# Altium schematic sheet 电子琴1组.SchDoc
size A4; SheetNumber: 1; SheetTotal: 1
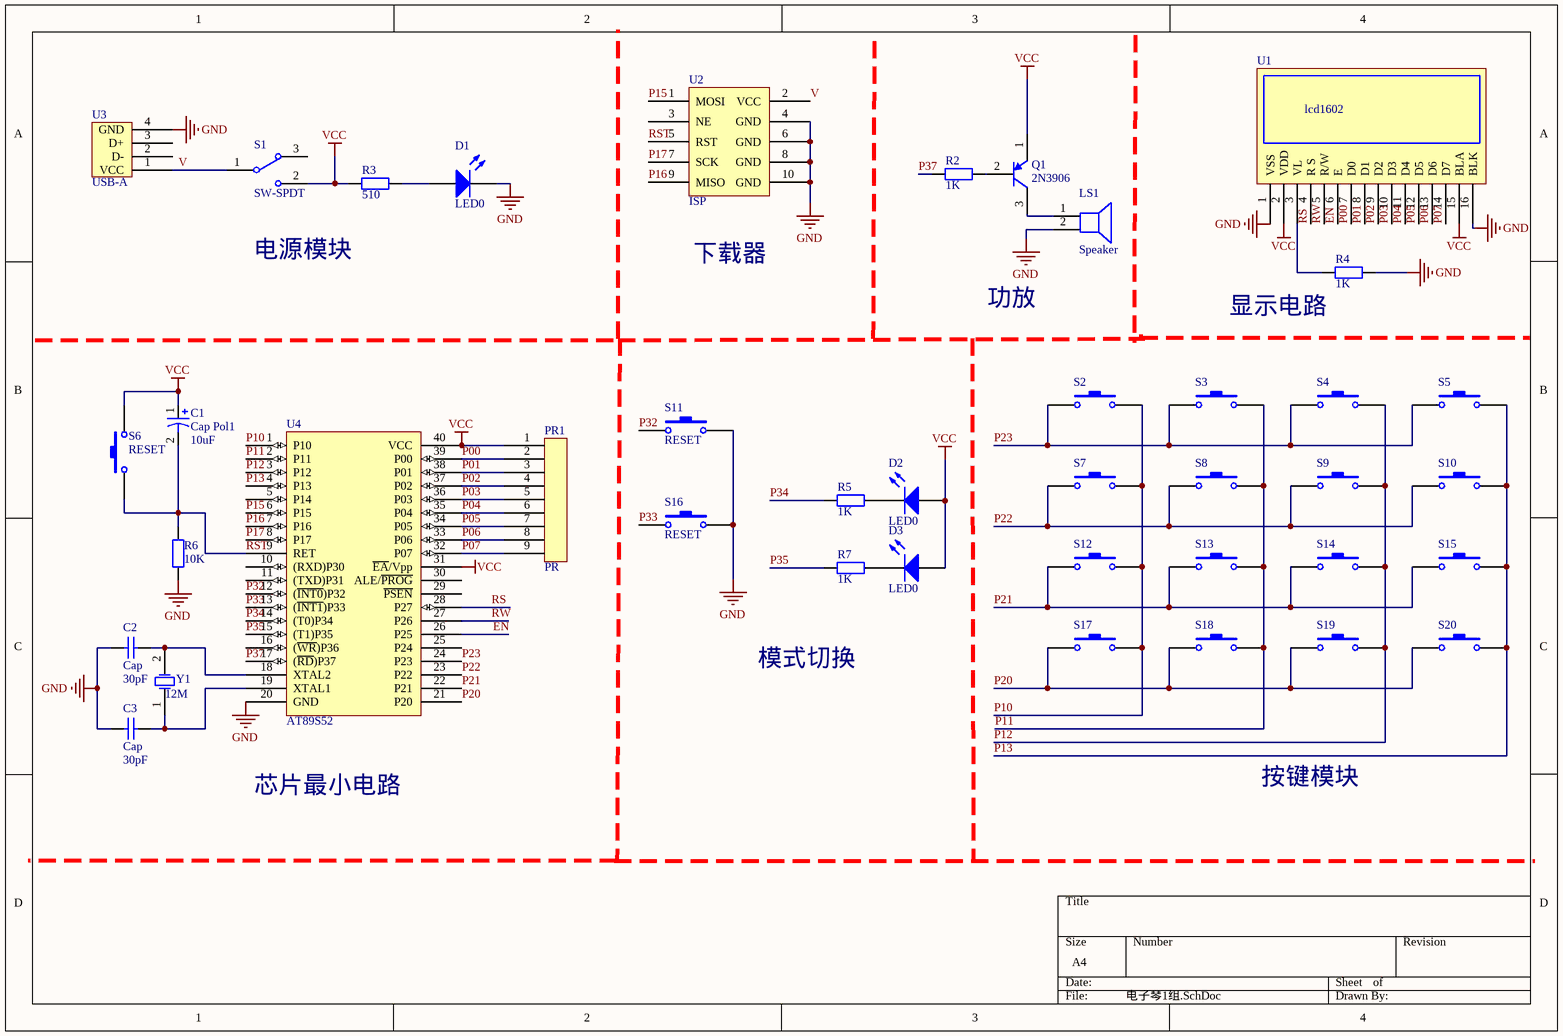
[diagram p0: 电子琴1组.SchDoc]

## Parts
C1  Cap Pol1  value 10uF  [RB0.1]
C2  Cap  value 30pF  [RAD-0.1]
C3  Cap  value 30pF  [RAD-0.1]
D1  LED0  [RB0.1]
D2  LED0  [RB0.1]
D3  LED0  [RB0.1]
LS1  Speaker  [Speaker]
PR1  PR  [SIP9]
Q1  2N3906  [TO-92-M]
R2  1K  [AXIAL-0.3]
R3  510  [AXIAL-0.3]
R4  1K  [AXIAL-0.3]
R5  1K  [AXIAL-0.3]
R6  10K  [AXIAL-0.3]
R7  1K  [AXIAL-0.3]
S1  SW-SPDT  [KEY-6 - duplicate]
S2  (no value)  [SPST6*6]
S3  (no value)  [SPST6*6]
S4  (no value)  [SPST6*6]
S5  (no value)  [SPST6*6]
S6  RESET  [SPST6*6]
S7  (no value)  [SPST6*6]
S8  (no value)  [SPST6*6]
S9  (no value)  [SPST6*6]
S10  (no value)  [SPST6*6]
S11  RESET  [SPST6*6]
S12  (no value)  [SPST6*6]
S13  (no value)  [SPST6*6]
S14  (no value)  [SPST6*6]
S15  (no value)  [SPST6*6]
S16  RESET  [SPST6*6]
S17  (no value)  [SPST6*6]
S18  (no value)  [SPST6*6]
S19  (no value)  [SPST6*6]
S20  (no value)  [SPST6*6]
U1  lcd1602  [LCD1602]
U2  ISP  [IDC10]
U3  USB-A  [USB_A]
U4  AT89S52  [DIP40_51MCU]
Y1  12M  [XTAL1]

## Nets
GND: C2.1 C3.1 D1.2(K) LS1.2 R4.2 R6.1 S11.2 S16.2 U1.1(VSS) U1.16(BLK) U2.4(GND) U2.6(GND) U2.8(GND) U2.10(GND) U3.4(GND) U4.20(GND)
VCC: C1.1 D2.1(A) D3.1(A) PR1.1 Q1.1(E) R3.1 S1.2 S6.2 U1.2(VDD) U1.15(BLA) U4.31(~{EA}/Vpp) U4.40(VCC)
EN: U1.6(E) U4.26(P25)
P00: PR1.2 U1.7(D0) U4.39(P00)
P01: PR1.3 U1.8(D1) U4.38(P01)
P02: PR1.4 U1.9(D2) U4.37(P02)
P03: PR1.5 U1.10(D3) U4.36(P03)
P04: PR1.6 U1.11(D4) U4.35(P04)
P05: PR1.7 U1.12(D5) U4.34(P05)
P06: PR1.8 U1.13(D6) U4.33(P06)
P07: PR1.9 U1.14(D7) U4.32(P07)
P10: S2.2 S7.2 S12.2 S17.2 U4.1(P10)
P11: S3.2 S8.2 S13.2 S18.2 U4.2(P11)
P12: S4.2 S9.2 S14.2 S19.2 U4.3(P12)
P13: S5.2 S10.2 S15.2 S20.2 U4.4(P13)
P15: U2.1(MOSI) U4.6(P15)
P16: U2.9(MISO) U4.7(P16)
P17: U2.7(SCK) U4.8(P17)
P20: S17.1 S18.1 S19.1 S20.1 U4.21(P20)
P21: S12.1 S13.1 S14.1 S15.1 U4.22(P21)
P22: S7.1 S8.1 S9.1 S10.1 U4.23(P22)
P23: S2.1 S3.1 S4.1 S5.1 U4.24(P23)
P32: S11.1 U4.12((~{INT0})P32)
P33: S16.1 U4.13((~{INT1})P33)
P34: R5.1 U4.14((T0)P34)
P35: R7.1 U4.15((T1)P35)
P37: R2.2 U4.17((~{RD})P37)
RS: U1.4(R_S) U4.28(P27)
RST: C1.2 R6.2 S6.1 U2.5(RST) U4.9(RET)
RW: U1.5(R/W) U4.27(P26)
V: S1.1 U2.2(VCC) U3.1(VCC)
NetC2_2: C2.2 U4.18(XTAL2) Y1.2(OSC2)
NetC3_2: C3.2 U4.19(XTAL1) Y1.1(OSC1)
NetD1_1: D1.1(A) R3.2
NetD2_2: D2.2(K) R5.2
NetD3_2: D3.2(K) R7.2
NetLS1_1: LS1.1 Q1.3(C)
NetQ1_2: Q1.2(B) R2.1
NetR4_1: R4.1 U1.3(VL)

Not connected (* = marked no-connect by the designer): S1 3; U2 3(NE); U3 2(D-) 3(D+); U4 5(P14) 10((RXD)P30) 11((TXD)P31) 16((~{WR})P36) 25(P24) 29(~{PSEN}) 30(ALE/~{PROG})

## Notes on the sheet
- 电源模块
- 下载器
- 功放
- 显示电路
- 模式切换
- 按键模块
- 芯片最小电路

## Library data of the parts
C1 = Cap Pol1: Polarized Capacitor (Radial); Published: 8-Jun-2000; LatestRevisionDate: 17-Jul-2002; LatestRevisionNote: Re-released for DXP Platform.; PackageReference: RB7.6-15; Publisher: Altium Limited; PackageDescription: Polarized Capacitor (Radial); 2 Leads
C2 C3 = Cap: Capacitor; Published: 8-Jun-2000; LatestRevisionDate: 17-Jul-2002; LatestRevisionNote: Re-released for DXP Platform.; PackageReference: RAD-0.3; Publisher: Altium Limited; PackageDescription: Radial Cap, Thru-Hole; 2 Leads; 0.3 in Pin Spacing
D1-D3 = LED0: Typical INFRARED GaAs LED; Published: 8-Jun-2000; LatestRevisionDate: 08-Jul-2005; LatestRevisionNote: Mech Layer 1 removed.; PackageReference: LED-0; Publisher: Altium Limited; PackageDescription: LED; 2 Leads
LS1 = Speaker: Loudspeaker; Published: 24-Mar-1999; LatestRevisionDate: 17-Jul-2002; LatestRevisionNote: Re-released for DXP Platform.; PackageReference: PIN2; Publisher: Altium Limited
Q1 = 2N3906: PNP General Purpose Amplifier; Published: 8-Jun-2000; LatestRevisionDate: 15-Jan-2003; LatestRevisionNote: PCB Footprint 'BCY-W3/D4.7' replaced; DatasheetVersion: 1997; PackageVersion: Sep-1998; PackageReference: TO-92A; Publisher: Altium Limited; PackageDescription: TO, Flat Index; 3 In-Line, Axial Leads; Body Dia. 4.5mm; Leads 0.51 x 0.48 mm (max); ComponentLink1Description: Manufacturer Link; ComponentLink1URL: http://www.fairchildsemi.com/; ComponentLink2Description: Datasheet; ComponentLink2URL: http://www.fairchildsemi.com/ds/2N%2F2N3906.pdf
R2 R4 R5 R7 = Res2: Resistor; Value: 10K; Published: 8-Jun-2000; LatestRevisionDate: 17-Jul-2002; LatestRevisionNote: Re-released for DXP Platform.; PackageReference: AXIAL-0.4; Publisher: Altium Limited; PackageDescription: Axial Device, Thru-Hole; 2 Leads; 0.4 in Pin Spacing
R3 R6 = Res2: Resistor; Published: 8-Jun-2000; LatestRevisionDate: 17-Jul-2002; LatestRevisionNote: Re-released for DXP Platform.; PackageReference: AXIAL-0.4; Publisher: Altium Limited; PackageDescription: Axial Device, Thru-Hole; 2 Leads; 0.4 in Pin Spacing
  R3: Value: 510
  R6: Value: 10K
S1 = SW-SPDT: SPDT Subminiature Toggle Switch, Right Angle Mounting, Vertical Actuation; Published: 24-Mar-1999; LatestRevisionDate: 17-Dec-2003; LatestRevisionNote: Schematic revised, PCB Footprint replaced.; DatasheetVersion: 05-Dec-2000; PackageReference: TL36WW15050; Publisher: Altium Limited; PackageDescription: Switch; 4 Leads; ComponentLink1Description: Manufacturer Link; ComponentLink1URL: http://www.apem.com
S2-S20 = SW-PB: Switch; Published: 24-Mar-1999; LatestRevisionDate: 17-Jul-2002; LatestRevisionNote: Re-released for DXP Platform.; PackageReference: SPST-2; Publisher: Altium Limited; PackageDescription: Switch; 2 Leads
Y1 = XTAL: Crystal Oscillator; Published: 8-Jun-2000; LatestRevisionDate: 17-Jul-2002; LatestRevisionNote: Re-released for DXP Platform.; PackageReference: R38; Publisher: Altium Limited; PackageDescription: Crystal, Thru-Hole; 2 Leads; Body 3.1 x 8.2 mm (Dia.xH)